# EAGLE schematic speed (EAGLE 8.2.2)
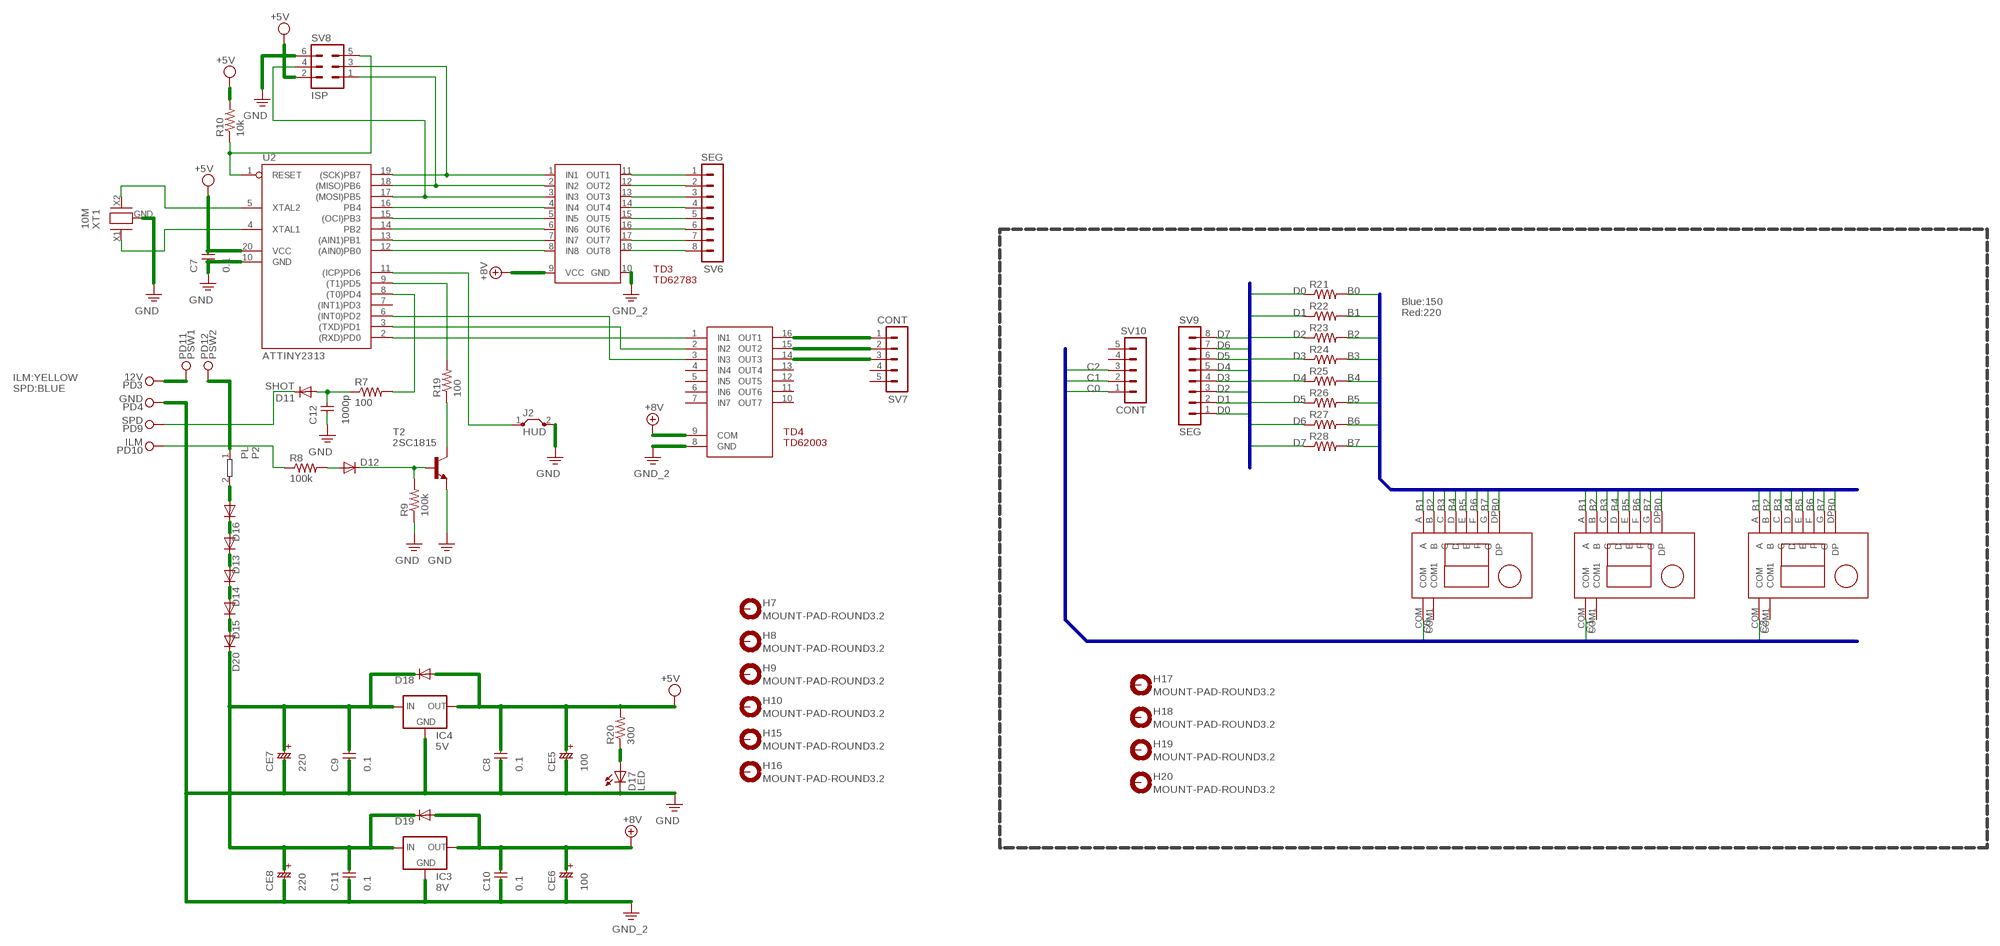
[diagram p0: schematic, sheet 1]

## Parts
C7  0.1  C-2,5  [C-2,5]
C8  0.1  C-2,5  [C-2,5]
C9  0.1  C-2,5  [C-2,5]
C10  0.1  C-2,5  [C-2,5]
C11  0.1  C-2,5  [C-2,5]
C12  1000p  C-2,5  [C-2,5]
CE5  100  ELC-2,5  [ELC-2,5]
CE6  100  ELC-2,5  [ELC-2,5]
CE7  220  ELC-5  [ELC-5]
CE8  220  ELC-5  [ELC-5]
D11  SHOT  1N4004T  [0204V]
D12  1N4004"  [DIP-2-10]
D13  1N4004T  [0204V]
D14  1N4004T  [0204V]
D15  1N4004T  [0204V]
D16  1N4004T  [0204V]
D17  LED  LED5MM  [LED5MM]
D18  1N4004T  [0204V]
D19  1N4004T  [0204V]
D20  1N4004T  [0204V]
H7  MOUNT-PAD-ROUND3.2  [3,2-PAD]
H8  MOUNT-PAD-ROUND3.2  [3,2-PAD]
H9  MOUNT-PAD-ROUND3.2  [3,2-PAD]
H10  MOUNT-PAD-ROUND3.2  [3,2-PAD]
H15  MOUNT-PAD-ROUND3.2  [3,2-PAD]
H16  MOUNT-PAD-ROUND3.2  [3,2-PAD]
H17  MOUNT-PAD-ROUND3.2  [3,2-PAD]
H18  MOUNT-PAD-ROUND3.2  [3,2-PAD]
H19  MOUNT-PAD-ROUND3.2  [3,2-PAD]
H20  MOUNT-PAD-ROUND3.2  [3,2-PAD]
IC3  8V  78XXLBACK  [78XXL]
IC4  5V  78XXS  [78XXS]
J2  HUD  J2MM  [JUMP2]
LED4  C-551X  [7SEG-0.56]
LED5  C-551X  [7SEG-0.56]
LED6  C-551X  [7SEG-0.56]
P2  PL  POLISWITCH  [0204/5]
PD3  12V  CPADF  [CFPAD]
PD4  GND  CPADF  [CFPAD]
PD9  SPD  CPADF  [CFPAD]
PD10  ILM  CPADF  [CFPAD]
PD11  PSW1  CPADP  [CPPAD]
PD12  PSW2  CPADP  [CPPAD]
R7  100  RES7  [0204/7]
R8  100k  RES7  [0204/7]
R9  100k  RES7  [0204/7]
R10  10k  RES7  [0204/7]
R19  100  RES7  [0204/7]
R20  300  RES_T  [0204V]
R21  RES7  [0204/7]
R22  RES7  [0204/7]
R23  RES7  [0204/7]
R24  RES7  [0204/7]
R25  RES7  [0204/7]
R26  RES7  [0204/7]
R27  RES7  [0204/7]
R28  RES7  [0204/7]
SV6  SEG  MA08-1  [MA08-1]
SV7  CONT  MA05-1  [MA05-1]
SV8  ISP  ML6  [ML6]
SV9  SEG  MA08-1  [MA08-1]
SV10  CONT  MA05-1  [MA05-1]
T2  2SC1815  [TO92]
TD3  TD62783  [DIP-18]
TD4  TD62003  [DIP-16]
U2  ATTINY2313  [DIP-20]
XT1  10M  CELALOCK  [CELALOCK]

## Nets
+5V/1 [SUPLLY]: C7.2 C8.2 CE5.PLUS D18.1(A) IC4.OUT R10.2 R20.2 SV8.2 U2.20(VCC) ; supply symbol labelled +5V
+9V [SUPLLY]: C10.2 CE6.PLUS D19.1(A) IC3.IN(OUT) TD3.9(VCC) TD4.9(COM) ; supply symbol labelled +8V
B0: LED4.DP LED5.DP LED6.DP R21.2
B1: LED4.A LED5.A LED6.A R22.2
B2: LED4.B LED5.B LED6.B R23.2
B3: LED4.C LED5.C LED6.C R24.2
B4: LED4.D LED5.D LED6.D R25.2
B5: LED4.E LED5.E LED6.E R26.2
B6: LED4.F LED5.F LED6.F R27.2
B7: LED4.G LED5.G LED6.G R28.2
C0 [SUPLLY]: LED4.COM SV10.1
C1 [SUPLLY]: LED5.COM SV10.2
C2 [SUPLLY]: LED6.COM SV10.3
D0: R21.1 SV9.1
D1: R22.1 SV9.2
D2: R23.1 SV9.3
D3: R24.1 SV9.4
D4: R25.1 SV9.5
D5: R26.1 SV9.6
D6: R27.1 SV9.7
D7: R28.1 SV9.8
N$38: R10.1 SV8.5 U2.1(RESET)
N$45: SV8.3 TD3.1(IN1) U2.19((SCK)PB7)
N$46: SV8.1 TD3.2(IN2) U2.18((MISO)PB6)
N$47: SV8.4 TD3.3(IN3) U2.17((MOSI)PB5)
N$48: TD3.4(IN4) U2.16(PB4)
N$49: TD3.5(IN5) U2.15((OCI)PB3)
N$50: TD3.6(IN6) U2.14(PB2)
N$51: TD3.7(IN7) U2.13((AIN1)PB1)
N$52: R7.2 U2.8((T0)PD4)
N$80: J2.1 U2.11((ICP)PD6)
N$81: C12.2 D11.1(A) R7.1
N$82: D11.2(C) PD9.CPAD(PAD)
N$83: D12.A R8.2
N$84: PD10.CPAD(PAD) R8.1
N$85: U2.5(XTAL2) XT1.X2
N$86: U2.4(XTAL1) XT1.X1
N$87: R19.2 U2.9((T1)PD5)
N$88: TD3.8(IN8) U2.12((AIN0)PB0)
N$89: TD4.1(IN1) U2.2((RXD)PD0)
N$90: TD4.2(IN2) U2.3((TXD)PD1)
N$91: TD4.3(IN3) U2.6((INT0)PD2)
N$92: SV7.1 TD4.16(OUT1)
N$93: SV7.2 TD4.15(OUT2)
N$94: SV7.3 TD4.14(OUT3)
N$95 [SUPLLY]: C9.2 C11.2 CE7.PLUS CE8.PLUS D18.2(C) D19.2(C) D20.2(C) IC3.OUT(IN) IC4.IN
N$96: D12.C R9.2 T2.1(B)
N$97 [SUPLLY]: P2.1 PD12.CPPAD(PAD)
N$98 [SUPLLY]: PD3.CPAD(PAD) PD11.CPPAD(PAD)
N$99: SV6.1 TD3.11(OUT1)
N$100: SV6.2 TD3.12(OUT2)
N$101: SV6.3 TD3.13(OUT3)
N$102: SV6.4 TD3.14(OUT4)
N$103: SV6.5 TD3.15(OUT5)
N$104: SV6.6 TD3.16(OUT6)
N$105: SV6.7 TD3.17(OUT7)
N$106: SV6.8 TD3.18(OUT8)
N$107 [SUPLLY]: D16.1(A) P2.2
N$108 [SUPLLY]: D13.1(A) D16.2(C)
N$109 [SUPLLY]: D13.2(C) D14.1(A)
N$110 [SUPLLY]: D14.2(C) D15.1(A)
N$111: R19.1 T2.2(C)
N$112: D17.A R20.1
N$113 [SUPLLY]: D15.2(C) D20.1(A)
PE [SUPLLY]: C7.1 C8.1 C9.1 C10.1 C11.1 C12.1 CE5.MAINAS CE6.MAINAS CE7.MAINAS CE8.MAINAS D17.K(C) IC3.GND IC4.GND J2.2 PD4.CPAD(PAD) R9.1 SV8.6 T2.3(E) TD3.10(GND) TD4.8(GND) U2.10(GND) XT1.GND ; supply symbol labelled GND, GND_2
Unconnected: H7.B3,2(MOUNT) H8.B3,2(MOUNT) H9.B3,2(MOUNT) H10.B3,2(MOUNT) H15.B3,2(MOUNT) H16.B3,2(MOUNT) H17.B3,2(MOUNT) H18.B3,2(MOUNT) H19.B3,2(MOUNT) H20.B3,2(MOUNT) LED4.COM1 LED5.COM1 LED6.COM1 SV7.4 SV7.5 SV10.4 SV10.5 TD4.4(IN4) TD4.5(IN5) TD4.6(IN6) TD4.7(IN7) TD4.10(OUT7) TD4.11(OUT6) TD4.12(OUT5) TD4.13(OUT4) U2.7((INT1)PD3)

## Buses
B[0..7]
C[0..3]
D[0..7]

## Notes on the sheet
- Blue:150
- Red:220
- ILM:YELLOW
- SPD:BLUE

## Library data of the parts
C7-C12 = myparts01:C-
CE5 CE6 = myparts01:ELC-
CE7 CE8 = myparts01:ELC-5
D11-D16 D18-D20 = myparts01:1N4004
D17 = myparts01:LED: IR LED infrared emitting diode, Infineon
H7-H10 H15-H20 = myparts01:MOUNT-PAD-ROUND: MOUNTING PAD, round
IC3 = myparts01:78XXL: VOLTAGE REGULATOR
IC4 = myparts01:78XXS: VOLTAGE REGULATOR
J2 = myparts01:J: Bridge
LED4-LED6 = myparts01:C-551X
P2 = myparts01:POLISWITCH
PD3 PD4 PD9-PD12 = myparts01:CPAD
R7-R10 R19 R21-R28 = myparts01:RES
R20 = myparts01:RES_T
SV6 SV9 = myparts01:MA08-1: PIN HEADER
SV7 SV10 = myparts01:MA05-1: PIN HEADER
SV8 = myparts01:ML6: HARTING
T2 = myparts01:2SC1815: NPN Transistor
TD3 = myparts01:TD62783
TD4 = myparts01:TD62003: TRANSISTOR ARRAY general purpose, high current common emitter
U2 = myparts01:ATTINY2313: Atmel ATTINY2313 DIP 20Pin FLASH 2kB RAM 128B EEPROM 128B MaxFreq 20MHz
XT1 = myparts01:CELALOCK

## Net classes
0 default: width 0.254 mm
1 SUPLLY: width 0.813 mm